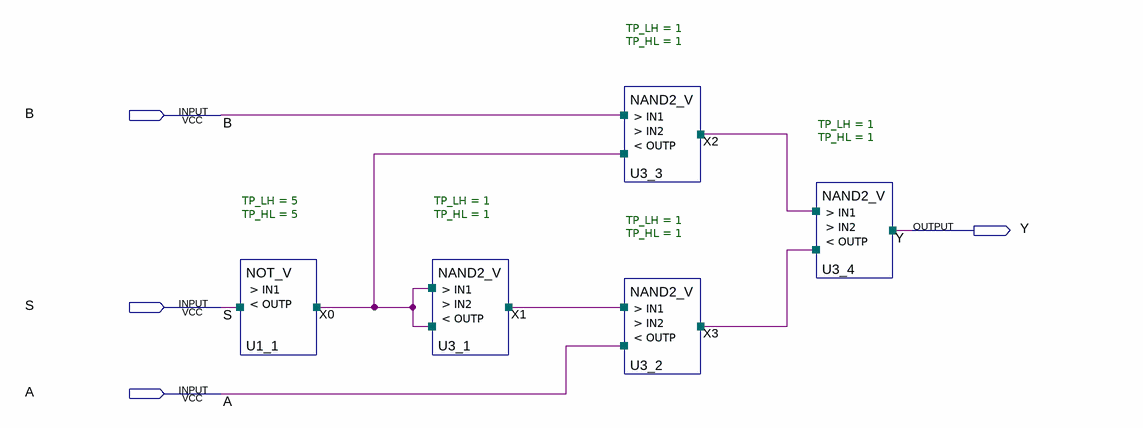
[diagram p0: schematic sheet]
// Quartus schematic ZVH_240_FImp.bdf as structural Verilog: 5 symbols, 4 pins
module ZVH_240_FImp (
  input  B,
  input  S,
  input  A,
  output Y
);

  wire X0, X1, X2, X3;

  NOT_V #(.TP_LH(5), .TP_HL(5)) U1_1 (.IN1(S), .OUTP(X0));
  NAND2_V #(.TP_LH(1), .TP_HL(1)) U3_1 (.IN1(X0), .IN2(X0), .OUTP(X1));
  NAND2_V #(.TP_LH(1), .TP_HL(1)) U3_3 (.IN1(B), .IN2(X0), .OUTP(X2));
  NAND2_V #(.TP_LH(1), .TP_HL(1)) U3_2 (.IN1(X1), .IN2(A), .OUTP(X3));
  NAND2_V #(.TP_LH(1), .TP_HL(1)) U3_4 (.IN1(X2), .IN2(X3), .OUTP(Y));
endmodule
